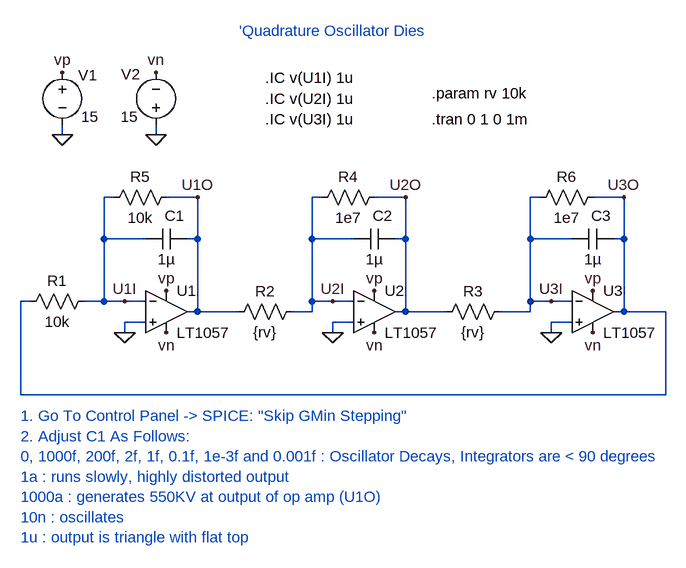
[diagram p0: schematic sinsqt02.asc]
sinsqt02.asc, the LTspice schematic file:
Version 4
SHEET 1 880 680
WIRE -368 -80 -368 -96
WIRE -224 -80 -224 -96
WIRE -288 16 -304 16
WIRE -160 16 -208 16
WIRE 32 16 16 16
WIRE 160 16 112 16
WIRE 368 16 352 16
WIRE 496 16 448 16
WIRE -304 80 -304 16
WIRE -240 80 -304 80
WIRE -160 80 -160 16
WIRE -160 80 -176 80
WIRE 16 80 16 16
WIRE 80 80 16 80
WIRE 160 80 160 16
WIRE 160 80 144 80
WIRE 352 80 352 16
WIRE 416 80 352 80
WIRE 496 80 496 16
WIRE 496 80 480 80
WIRE -416 176 -432 176
WIRE -304 176 -304 80
WIRE -304 176 -336 176
WIRE -272 176 -304 176
WIRE -240 176 -272 176
WIRE 16 176 16 80
WIRE 48 176 16 176
WIRE 80 176 48 176
WIRE 352 176 352 80
WIRE 384 176 352 176
WIRE 416 176 384 176
WIRE -160 192 -160 80
WIRE -160 192 -176 192
WIRE -96 192 -160 192
WIRE 16 192 16 176
WIRE 16 192 -16 192
WIRE 160 192 160 80
WIRE 160 192 144 192
WIRE 224 192 160 192
WIRE 352 192 352 176
WIRE 352 192 304 192
WIRE 496 192 496 80
WIRE 496 192 480 192
WIRE 560 192 496 192
WIRE -240 208 -272 208
WIRE 80 208 48 208
WIRE 416 208 384 208
WIRE -272 224 -272 208
WIRE 48 224 48 208
WIRE 384 224 384 208
WIRE -432 320 -432 176
WIRE 560 320 560 192
WIRE 560 320 -432 320
FLAG -368 -80 0
FLAG -224 -80 0
FLAG -368 -176 vp
FLAG -224 -176 vn
FLAG -208 160 vp
FLAG -208 224 vn
FLAG -272 224 0
FLAG -160 16 U1O
FLAG 112 160 vp
FLAG 112 224 vn
FLAG 48 224 0
FLAG 160 16 U2O
FLAG 448 160 vp
FLAG 448 224 vn
FLAG 384 224 0
FLAG 496 16 U3O
FLAG 48 176 U2I
FLAG -272 176 U1I
FLAG 384 176 U3I
SYMBOL voltage -368 -192 R0
WINDOW 123 0 0 Left 0
WINDOW 39 0 0 Left 0
WINDOW 0 24 20 Left 0
WINDOW 3 29 84 Left 0
SYMATTR InstName V1
SYMATTR Value 15
SYMBOL voltage -224 -80 R180
WINDOW 0 24 93 Left 0
WINDOW 3 27 28 Left 0
WINDOW 123 0 0 Left 0
WINDOW 39 0 0 Left 0
SYMATTR InstName V2
SYMATTR Value 15
SYMBOL res -320 160 R90
WINDOW 0 0 56 VBottom 0
WINDOW 3 32 56 VTop 0
SYMATTR InstName R1
SYMATTR Value 10k
SYMBOL cap -176 64 R90
WINDOW 0 -4 19 VBottom 0
WINDOW 3 32 32 VTop 0
SYMATTR InstName C1
SYMATTR Value 1µ
SYMBOL OPAMPS\\LT1057 -208 128 R0
SYMATTR InstName U1
SYMBOL res -192 0 R90
WINDOW 0 0 56 VBottom 0
WINDOW 3 32 56 VTop 0
SYMATTR InstName R5
SYMATTR Value 10k
SYMBOL res 0 176 R90
WINDOW 0 0 56 VBottom 0
WINDOW 3 32 56 VTop 0
SYMATTR InstName R2
SYMATTR Value {rv}
SYMBOL cap 144 64 R90
WINDOW 0 -4 19 VBottom 0
WINDOW 3 32 32 VTop 0
SYMATTR InstName C2
SYMATTR Value 1µ
SYMBOL OPAMPS\\LT1057 112 128 R0
SYMATTR InstName U2
SYMBOL cap 480 64 R90
WINDOW 0 -4 19 VBottom 0
WINDOW 3 32 32 VTop 0
SYMATTR InstName C3
SYMATTR Value 1µ
SYMBOL OPAMPS\\LT1057 448 128 R0
SYMATTR InstName U3
SYMBOL res 128 0 R90
WINDOW 0 0 56 VBottom 0
WINDOW 3 32 56 VTop 0
SYMATTR InstName R4
SYMATTR Value 1e7
SYMBOL res 464 0 R90
WINDOW 0 0 56 VBottom 0
WINDOW 3 32 56 VTop 0
SYMATTR InstName R6
SYMATTR Value 1e7
SYMBOL res 320 176 R90
WINDOW 0 0 56 VBottom 0
WINDOW 3 32 56 VTop 0
SYMATTR InstName R3
SYMATTR Value {rv}
TEXT 200 -104 Left 0 !.tran 0 1 0 1m
TEXT -96 -240 Left 0 ;'Quadrature Oscillator Dies
TEXT 200 -144 Left 0 !.param rv 10k
TEXT -56 -136 Left 0 !.IC v(U2I) 1u
TEXT -56 -168 Left 0 !.IC v(U1I) 1u
TEXT -56 -104 Left 0 !.IC v(U3I) 1u
TEXT -432 352 Left 0 ;1. Go To Control Panel -> SPICE: "Skip GMin Stepping"\n2. Adjust C1 As Follows:\n0, 1000f, 200f, 2f, 1f, 0.1f, 1e-3f and 0.001f : Oscillator Decays, Integrators are < 90 degrees\n1a : runs slowly, highly distorted output\n1000a : generates 550KV at output of op amp (U1O)\n10n : oscillates\n1u : output is triangle with flat top

The netlist it stands for:
* sinsqt02.asc
V1 vp 0 15
V2 0 vn 15
R1 U1I U3O 10k
C1 U1O U1I 1µ
XU1 0 U1I vp vn U1O LT1057  ; pins In+ In- V+ V- OUT
R5 U1O U1I 10k
R2 U2I U1O {rv}
C2 U2O U2I 1µ
XU2 0 U2I vp vn U2O LT1057  ; pins In+ In- V+ V- OUT
C3 U3O U3I 1µ
XU3 0 U3I vp vn U3O LT1057  ; pins In+ In- V+ V- OUT
R4 U2O U2I 1e7
R6 U3O U3I 1e7
R3 U3I U2O {rv}
.tran 0 1 0 1m
* 'Quadrature Oscillator Dies
.param rv 10k
.IC v(U2I) 1u
.IC v(U1I) 1u
.IC v(U3I) 1u
* 1. Go To Control Panel -> SPICE: "Skip GMin Stepping"
* 2. Adjust C1 As Follows:
* 0, 1000f, 200f, 2f, 1f, 0.1f, 1e-3f and 0.001f : Oscillator Decays, Integrators are < 90 degrees
* 1a : runs slowly, highly distorted output
* 1000a : generates 550KV at output of op amp (U1O)
* 10n : oscillates
* 1u : output is triangle with flat top
.lib LTC.lib
.backanno
.end